# Altium project Motherboard refurb.PrjPcb (part 1 of 2)
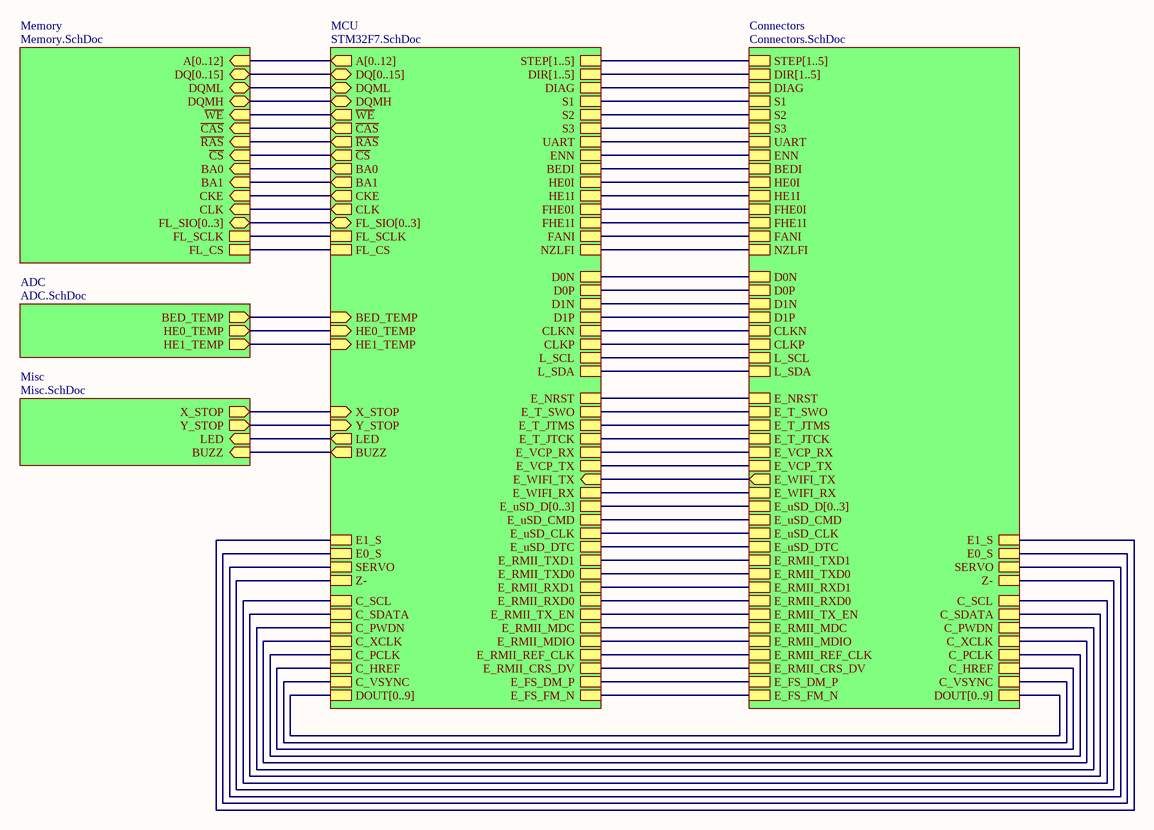
[diagram p0: Motherboard.SchDoc]
6 sheets, 89 parts. Net scope: hierarchical (ports join the sheet entries above them; power ports are global).
Board file: PCB2.PcbDoc
Sheets:
  Motherboard.SchDoc
    MCU = STM32F7.SchDoc
    Connectors = Connectors.SchDoc
    Memory = Memory.SchDoc
    ADC = ADC.SchDoc
    Misc = Misc.SchDoc

## Sheet Motherboard.SchDoc
size A4; SheetNumber: 1; SheetTotal: 6

### Sub-sheets
ADC = ADC.SchDoc: BED_TEMP (out), HE0_TEMP (out), HE1_TEMP (out)
Connectors = Connectors.SchDoc: ENN, STEP[1..5], BEDI, NZLFI, FANI, UART, S3, HE0I, HE1I, S2, S1, FHE0I, FHE1I, DIR[1..5], DIAG, D1N, D1P, D0N, D0P, CLKN, CLKP, L_SCL, L_SDA, E_NRST, E_T_SWO, E_uSD_CLK, E_RMII_TXD0, E_WIFI_RX, E_uSD_D[0..3], E_VCP_RX, E_VCP_TX, E_T_JTCK, E_T_JTMS, E_uSD_DTC, E_FS_DM_P, E_FS_FM_N, E_RMII_CRS_DV, E_RMII_MDC, E_RMII_RXD0, E_RMII_TX_EN, E_uSD_CMD, E_RMII_MDIO, E_RMII_REF_CLK, E_RMII_RXD1, E_RMII_TXD1, DOUT[0..9], C_VSYNC, C_HREF, C_PCLK, C_XCLK, C_PWDN, C_SDATA, C_SCL, Z-, SERVO, E0_S, E1_S, E_WIFI_TX (out)
MCU = STM32F7.SchDoc: A[0..12] (out), DQ[0..15] (bidir), DQML (bidir), DQMH (bidir), ~{WE} (out), ~{CAS} (out), ~{RAS} (out), ~{CS} (out), BA0 (out), BA1 (out), CKE (out), CLK (out), FL_SIO[0..3] (bidir), FL_SCLK, FL_CS, BED_TEMP (in), HE0_TEMP (in), HE1_TEMP (in), X_STOP (in), Y_STOP (in), LED (out), BUZZ (out), STEP[1..5], DIR[1..5], DIAG, S1, S2, S3, UART, ENN, BEDI, HE0I, HE1I, FHE0I, FHE1I, FANI, NZLFI, D0N, D0P, D1N, D1P, CLKN, CLKP, L_SCL, L_SDA, E_NRST, E_T_SWO, E_uSD_CLK, E_RMII_TXD0, E_WIFI_RX, E_T_JTMS, E_T_JTCK, E_VCP_RX, E_VCP_TX, E_uSD_D[0..3], E_uSD_CMD, E_uSD_DTC, E_RMII_TXD1, E_RMII_RXD1, E_RMII_RXD0, E_RMII_TX_EN, E_RMII_MDC, E_RMII_MDIO, E_RMII_REF_CLK, E_RMII_CRS_DV, E_FS_DM_P, E_FS_FM_N, DOUT[0..9], C_VSYNC, C_HREF, C_PCLK, C_XCLK, C_PWDN, C_SDATA, C_SCL, Z-, SERVO, E0_S, E1_S, E_WIFI_TX (in)
Memory = Memory.SchDoc: A[0..12] (in), DQ[0..15] (bidir), DQML (bidir), DQMH (bidir), ~{WE} (in), ~{CAS} (in), ~{RAS} (in), ~{CS} (in), BA0 (in), BA1 (in), CKE (in), CLK (in), FL_SIO[0..3] (bidir), FL_SCLK, FL_CS
Misc = Misc.SchDoc: X_STOP (out), Y_STOP (out), LED (in), BUZZ (in)

### Nets
~{CAS}: sheet MCU/~{CAS}, sheet Memory/~{CAS}
~{CS}: sheet MCU/~{CS}, sheet Memory/~{CS}
~{RAS}: sheet MCU/~{RAS}, sheet Memory/~{RAS}
~{WE}: sheet MCU/~{WE}, sheet Memory/~{WE}
BA0: sheet MCU/BA0, sheet Memory/BA0
BA1: sheet MCU/BA1, sheet Memory/BA1
BED: sheet MCU/BEDI, sheet Connectors/BEDI
BED_TEMP: sheet MCU/BED_TEMP, sheet ADC/BED_TEMP
BUZZER: sheet MCU/BUZZ, sheet Misc/BUZZ
C_VSYNC: sheet MCU/C_VSYNC, sheet Connectors/C_VSYNC
CKE: sheet MCU/CKE, sheet Memory/CKE
CLK: sheet MCU/CLK, sheet Memory/CLK
CLKN: sheet MCU/CLKN, sheet Connectors/CLKN
CLKP: sheet MCU/CLKP, sheet Connectors/CLKP
CS: sheet MCU/FL_CS, sheet Memory/FL_CS
D0N: sheet MCU/D0N, sheet Connectors/D0N
D0P: sheet MCU/D0P, sheet Connectors/D0P
D1N: sheet MCU/D1N, sheet Connectors/D1N
D1P: sheet MCU/D1P, sheet Connectors/D1P
DIAG: sheet MCU/DIAG, sheet Connectors/DIAG
DQMH: sheet MCU/DQMH, sheet Memory/DQMH
DQML: sheet MCU/DQML, sheet Memory/DQML
E0: sheet MCU/E0_S, sheet Connectors/E0_S
E1: sheet MCU/E1_S, sheet Connectors/E1_S
ENN: sheet MCU/ENN, sheet Connectors/ENN
ENRST: sheet MCU/E_NRST, sheet Connectors/E_NRST
ET_JTCK: sheet MCU/E_T_JTCK, sheet Connectors/E_T_JTCK
ET_JTMS: sheet MCU/E_T_JTMS, sheet Connectors/E_T_JTMS
ET_SWO: sheet MCU/E_T_SWO, sheet Connectors/E_T_SWO
FAN: sheet MCU/FANI, sheet Connectors/FANI
FHE0: sheet MCU/FHE0I, sheet Connectors/FHE0I
FHE1: sheet MCU/FHE1I, sheet Connectors/FHE1I
FS_DM_N: sheet MCU/E_FS_FM_N, sheet Connectors/E_FS_FM_N
FS_DM_P: sheet MCU/E_FS_DM_P, sheet Connectors/E_FS_DM_P
HE0: sheet MCU/HE0I, sheet Connectors/HE0I
HE0_TEMP: sheet MCU/HE0_TEMP, sheet ADC/HE0_TEMP
HE1: sheet MCU/HE1I, sheet Connectors/HE1I
HE1_TEMP: sheet MCU/HE1_TEMP, sheet ADC/HE1_TEMP
HREF: sheet MCU/C_HREF, sheet Connectors/C_HREF
LED: sheet MCU/LED, sheet Misc/LED
NZLF: sheet MCU/NZLFI, sheet Connectors/NZLFI
PCLK: sheet MCU/C_PCLK, sheet Connectors/C_PCLK
PWDN: sheet MCU/C_PWDN, sheet Connectors/C_PWDN
RMII_CRS_DV: sheet MCU/E_RMII_CRS_DV, sheet Connectors/E_RMII_CRS_DV
RMII_MDC: sheet MCU/E_RMII_MDC, sheet Connectors/E_RMII_MDC
RMII_MDIO: sheet MCU/E_RMII_MDIO, sheet Connectors/E_RMII_MDIO
RMII_REF_CLK: sheet MCU/E_RMII_REF_CLK, sheet Connectors/E_RMII_REF_CLK
RMII_RXD0: sheet MCU/E_RMII_RXD0, sheet Connectors/E_RMII_RXD0
RMII_RXD1: sheet MCU/E_RMII_RXD1, sheet Connectors/E_RMII_RXD1
RMII_TX_EN: sheet MCU/E_RMII_TX_EN, sheet Connectors/E_RMII_TX_EN
RMII_TXD0: sheet MCU/E_RMII_TXD0, sheet Connectors/E_RMII_TXD0
RMII_TXD1: sheet MCU/E_RMII_TXD1, sheet Connectors/E_RMII_TXD1
S1: sheet MCU/S1, sheet Connectors/S1
S2: sheet MCU/S2, sheet Connectors/S2
S3: sheet MCU/S3, sheet Connectors/S3
SCL: sheet MCU/C_SCL, sheet Connectors/C_SCL
SCL1: sheet MCU/L_SCL, sheet Connectors/L_SCL
SCLK: sheet MCU/FL_SCLK, sheet Memory/FL_SCLK
SDA1: sheet MCU/L_SDA, sheet Connectors/L_SDA
SDATA: sheet MCU/C_SDATA, sheet Connectors/C_SDATA
SRV: sheet MCU/SERVO, sheet Connectors/SERVO
UART: sheet MCU/UART, sheet Connectors/UART
uSD_CLK: sheet MCU/E_uSD_CLK, sheet Connectors/E_uSD_CLK
uSD_CMD: sheet MCU/E_uSD_CMD, sheet Connectors/E_uSD_CMD
uSD_DETECT: sheet MCU/E_uSD_DTC, sheet Connectors/E_uSD_DTC
VCP_RX: sheet MCU/E_VCP_RX, sheet Connectors/E_VCP_RX
VCP_TX: sheet MCU/E_VCP_TX, sheet Connectors/E_VCP_TX
WIFI_RX: sheet MCU/E_WIFI_RX, sheet Connectors/E_WIFI_RX
WIFI_TX: sheet MCU/E_WIFI_TX, sheet Connectors/E_WIFI_TX
X_STOP: sheet MCU/X_STOP, sheet Misc/X_STOP
XCLK: sheet MCU/C_XCLK, sheet Connectors/C_XCLK
Y_STOP: sheet MCU/Y_STOP, sheet Misc/Y_STOP
Z-: sheet MCU/Z-, sheet Connectors/Z-

### Buses and harness runs
bus sheet Connectors/DIR[1..5] = sheet MCU/DIR[1..5]
bus sheet Connectors/DOUT[0..9] = sheet MCU/DOUT[0..9]
bus sheet Connectors/E_uSD_D[0..3] = sheet MCU/E_uSD_D[0..3]
bus sheet Connectors/STEP[1..5] = sheet MCU/STEP[1..5]
bus sheet MCU/A[0..12] = sheet Memory/A[0..12]
bus sheet MCU/DQ[0..15] = sheet Memory/DQ[0..15]
bus sheet MCU/FL_SIO[0..3] = sheet Memory/FL_SIO[0..3]

## Sheet STM32F7.SchDoc
size A4; SheetNumber: 4; SheetTotal: 6
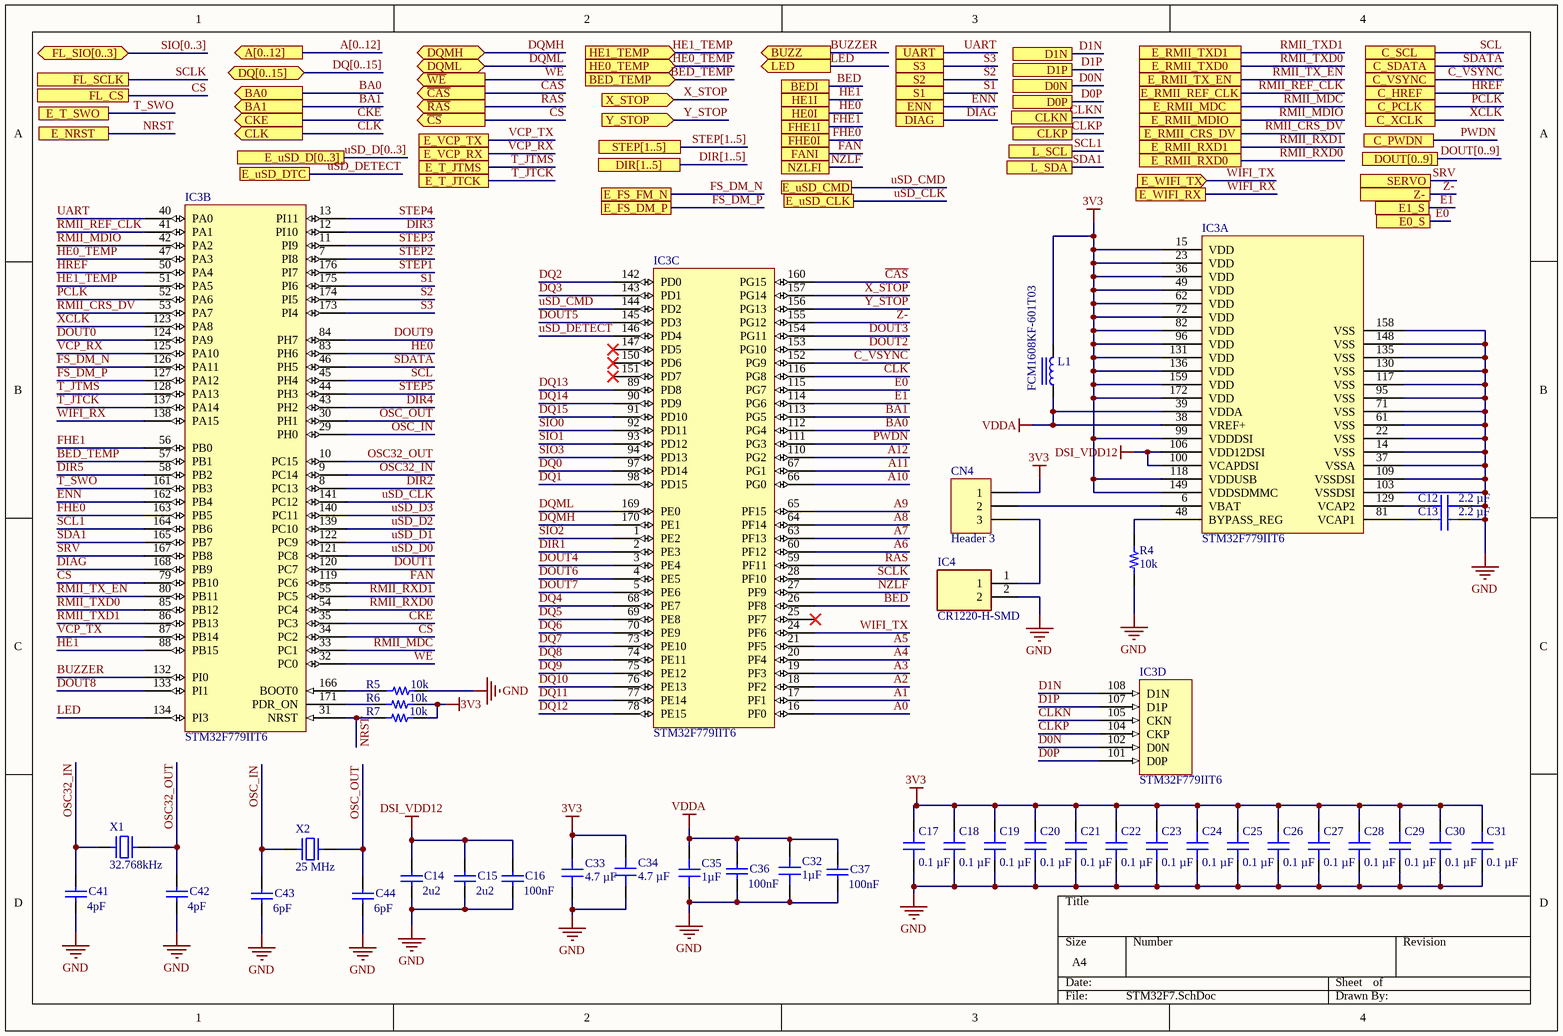
[diagram p1: STM32F7.SchDoc]

### Parts
(Parts that share a designator on the sheet are numbered #1, #2 ... from top to bottom, then left to right.)
C12  2.2 µF  [CAP 0603_1608]
C13  2.2 µF  [CAP 0603_1608]
C14  value 2u2  [1608[0603]]  (hidden comment: X5R)
C15  value 2u2  [1608[0603]]  (hidden comment: X5R)
C16  value 100nF  [1608[0603]]  (hidden comment: X5R)
C17  0.1 µF  [CAP 0603_1608]
C18  0.1 µF  [CAP 0603_1608]
C19  0.1 µF  [CAP 0603_1608]
C20  0.1 µF  [CAP 0603_1608]
C21  0.1 µF  [CAP 0603_1608]
C22  0.1 µF  [CAP 0603_1608]
C23  0.1 µF  [CAP 0603_1608]
C24  0.1 µF  [CAP 0603_1608]
C25  0.1 µF  [CAP 0603_1608]
C26  0.1 µF  [CAP 0603_1608]
C27  0.1 µF  [CAP 0603_1608]
C28  0.1 µF  [CAP 0603_1608]
C29  0.1 µF  [CAP 0603_1608]
C30  0.1 µF  [CAP 0603_1608]
C31  0.1 µF  [CAP 0603_1608]
C32  1µF  [CAP 0603_1608]
C33  4.7 µF  [CAP 0603_1608]
C34  4.7 µF  [CAP 0603_1608]
C35  1µF  [CAP 0603_1608]
C36  value 100nF  [1608[0603]]  (hidden comment: X5R)
C37  value 100nF  [1608[0603]]  (hidden comment: X5R)
C41  value 4pF  [1608[0603]]  (hidden comment: X5R)
C42  value 4pF  [1608[0603]]  (hidden comment: X5R)
C43  value 6pF  [1608[0603]]  (hidden comment: X5R)
C44  value 6pF  [1608[0603]]  (hidden comment: X5R)
CN4  Header 3  [HDR1X3]
IC3#1  STM32F779IIT6  [QFP50P2600X2600X160-176N]  (parts A,B,C of 3)
IC3#2  STM32F779IIT6  [QFP50P2600X2600X160-176N]  (part D of 4)
IC4  CR1220-H-SMD  [CR1220HSMD]
L1  FCM1608KF-601T03  [IND 0603_1608 RF WW]
R4  10k  [RES 0603_1608]
R5  10k  [RES 0603_1608]
R6  10k  [RES 0603_1608]
R7  10k  [RES 0603_1608]
X1  32.768kHz  [NDK NX5032GA]
X2  25 MHz  [NDK NX5032GA]

### Ports
A[0..12] (out, see Motherboard[2A], Memory[2A]), BA0 (out, see Motherboard[2A], Memory[4B]), BA1 (out, see Motherboard[2A], Memory[4B]), BED_TEMP (in, see Motherboard[2B], ADC[3D]), BEDI (see Motherboard[2A], Connectors[1A]), BUZZ (out, see Motherboard[2B], Misc[3C]), C_HREF (see Motherboard[2C], Connectors[2C]), C_PCLK (see Motherboard[2C], Connectors[2C]), C_PWDN (see Motherboard[2C], Connectors[3C]), C_SCL (see Motherboard[2C], Connectors[2C]), C_SDATA (see Motherboard[2C], Connectors[2C]), C_VSYNC (see Motherboard[2C], Connectors[2C]), C_XCLK (see Motherboard[2C], Connectors[2C]), CKE (out, see Motherboard[2A], Memory[4B]), CLK (out, see Motherboard[2A], Memory[4B]), CLKN (see Motherboard[2B], Connectors[3A]), CLKP (see Motherboard[2B], Connectors[3A]), D0N (see Motherboard[2B], Connectors[3A]), D0P (see Motherboard[2B], Connectors[3A]), D1N (see Motherboard[2B], Connectors[3A]), D1P (see Motherboard[2B], Connectors[3A]), DIAG (see Motherboard[2A], Connectors[1B]), DIR[1..5] (see Motherboard[2A], Connectors[2B]), DOUT[0..9] (see Motherboard[2C], Connectors[3B]), DQ[0..15] (bidir, see Motherboard[2A], Memory[3A]), DQMH (bidir, see Motherboard[2A], Memory[4B]), DQML (bidir, see Motherboard[2A], Memory[4B]), E0_S (see Motherboard[2C], Connectors[1C]), E1_S (see Motherboard[2C], Connectors[1C]), E_FS_DM_P (see Motherboard[2C], Connectors[4B]), E_FS_FM_N (see Motherboard[2C], Connectors[4B]), E_NRST (see Motherboard[2B], Connectors[4A]), E_RMII_CRS_DV (see Motherboard[2C], Connectors[4B]), E_RMII_MDC (see Motherboard[2C], Connectors[4B]), E_RMII_MDIO (see Motherboard[2C], Connectors[4B]), E_RMII_REF_CLK (see Motherboard[2C], Connectors[4B]), E_RMII_RXD0 (see Motherboard[2C], Connectors[4B]), E_RMII_RXD1 (see Motherboard[2C], Connectors[4B]), E_RMII_TX_EN (see Motherboard[2C], Connectors[4B]), E_RMII_TXD0 (see Motherboard[2C], Connectors[4B]), E_RMII_TXD1 (see Motherboard[2C], Connectors[4B]), E_T_JTCK (see Motherboard[2B], Connectors[4A]), E_T_JTMS (see Motherboard[2B], Connectors[4A]), E_T_SWO (see Motherboard[2B], Connectors[4A]), E_uSD_CLK (see Motherboard[2C], Connectors[4A]), E_uSD_CMD (see Motherboard[2C], Connectors[4A]), E_uSD_D[0..3] (see Motherboard[2C], Connectors[4A]), E_uSD_DTC (see Motherboard[2C], Connectors[4A]), E_VCP_RX (see Motherboard[2B], Connectors[4A]), E_VCP_TX (see Motherboard[2B], Connectors[4A]), E_WIFI_RX (see Motherboard[2C], Connectors[4B]), E_WIFI_TX (in, see Motherboard[2B], Connectors[4B]), ENN (see Motherboard[2A], Connectors[1B]), FANI (see Motherboard[2B], Connectors[1A]), FHE0I (see Motherboard[2A], Connectors[1A]), FHE1I (see Motherboard[2A], Connectors[1A]), FL_CS (see Motherboard[2B], Memory[2C]), FL_SCLK (see Motherboard[2B], Memory[2C]), FL_SIO[0..3] (bidir, see Motherboard[2A], Memory[2C]), HE0_TEMP (in, see Motherboard[2B], ADC[1D]), HE0I (see Motherboard[2A], Connectors[1A]), HE1_TEMP (in, see Motherboard[2B], ADC[3C]), HE1I (see Motherboard[2A], Connectors[1A]), L_SCL (see Motherboard[2B], Connectors[3A]), L_SDA (see Motherboard[2B], Connectors[3A]), LED (out, see Motherboard[2B], Misc[3B]), NZLFI (see Motherboard[2B], Connectors[1A]), S1 (see Motherboard[2A], Connectors[1B]), S2 (see Motherboard[2A], Connectors[1B]), S3 (see Motherboard[2A], Connectors[1B]), SERVO (see Motherboard[2C], Connectors[1D]), STEP[1..5] (see Motherboard[2A], Connectors[2B]), UART (see Motherboard[2A], Connectors[1B]), X_STOP (in, see Motherboard[2B], Misc[3B]), Y_STOP (in, see Motherboard[2B], Misc[3B]), Z- (see Motherboard[2C], Connectors[1D]), ~{CAS} (out, see Motherboard[2A], Memory[4B]), ~{CS} (out, see Motherboard[2A], Memory[4B]), ~{RAS} (out, see Motherboard[2A], Memory[4B]), ~{WE} (out, see Motherboard[2A], Memory[4B])

### Nets
3V3: C17.2 C18.2 C19.2 C20.2 C21.2 C22.2 C23.2 C24.2 C25.2 C26.2 C27.2 C28.2 C29.2 C30.2 C31.2 C33.2 C34.2 CN4.1 IC3#1.15(VDD) IC3#1.23(VDD) IC3#1.36(VDD) IC3#1.49(VDD) IC3#1.62(VDD) IC3#1.72(VDD) IC3#1.82(VDD) IC3#1.96(VDD) IC3#1.99(VDDDSI) IC3#1.118(VDDUSB) IC3#1.131(VDD) IC3#1.136(VDD) IC3#1.149(VDDSDMMC) IC3#1.159(VDD) IC3#1.172(VDD) L1.2 R6.1 R7.2
DSI_VDD12: C14.1 C15.1 C16.1 IC3#1.100(VCAPDSI) IC3#1.106(VDD12DSI)
GND: C12.1 C13.1 C14.2 C15.2 C16.2 C17.1 C18.1 C19.1 C20.1 C21.1 C22.1 C23.1 C24.1 C25.1 C26.1 C27.1 C28.1 C29.1 C30.1 C31.1 C32.1 C33.1 C34.1 C35.1 C36.2 C37.2 C41.2 C42.2 C43.2 C44.2 IC3#1.14(VSS) IC3#1.22(VSS) IC3#1.37(VSSA) IC3#1.61(VSS) IC3#1.71(VSS) IC3#1.95(VSS) IC3#1.103(VSSDSI) IC3#1.109(VSSDSI) IC3#1.117(VSS) IC3#1.130(VSS) IC3#1.135(VSS) IC3#1.148(VSS) IC3#1.158(VSS) IC4.2 R4.2 R5.2
VDDA: C32.2 C35.2 C36.1 C37.1 IC3#1.38(VREF+) IC3#1.39(VDDA) L1.1
~{CAS}: IC3#1.160(PG15) ; port ~{CAS}
~{CS}: IC3#1.34(PC2) ; port ~{CS}
~{RAS}: IC3#1.59(PF11) ; port ~{RAS}
~{WE}: IC3#1.32(PC0) ; port ~{WE}
A0: IC3#1.16(PF0)
A1: IC3#1.17(PF1)
A2: IC3#1.18(PF2)
A3: IC3#1.19(PF3)
A4: IC3#1.20(PF4)
A5: IC3#1.21(PF5)
A6: IC3#1.60(PF12)
A7: IC3#1.63(PF13)
A8: IC3#1.64(PF14)
A9: IC3#1.65(PF15)
A10: IC3#1.66(PG0)
A11: IC3#1.67(PG1)
A12: IC3#1.110(PG2)
BA0: IC3#1.112(PG4) ; port BA0
BA1: IC3#1.113(PG5) ; port BA1
BED: IC3#1.26(PF8) ; port BEDI
BED_TEMP: IC3#1.57(PB1) ; port BED_TEMP
BUZZER: IC3#1.132(PI0) ; port BUZZ
C_VSYNC: IC3#1.152(PG9) ; port C_VSYNC
CKE: IC3#1.35(PC3) ; port CKE
CLK: IC3#1.116(PG8) ; port CLK
CLKN: IC3#2.105(CKN) ; port CLKN
CLKP: IC3#2.104(CKP) ; port CLKP
CS: IC3#1.79(PB10) ; port FL_CS
D0N: IC3#2.102(D0N) ; port D0N
D0P: IC3#2.101(D0P) ; port D0P
D1N: IC3#2.108(D1N) ; port D1N
D1P: IC3#2.107(D1P) ; port D1P
DIAG: IC3#1.168(PB9) ; port DIAG
DIR1: IC3#1.2(PE3)
DIR2: IC3#1.8(PC13)
DIR3: IC3#1.12(PI10)
DIR4: IC3#1.43(PH2)
DIR5: IC3#1.58(PB2)
DOUT0: IC3#1.124(PA9)
DOUT1: IC3#1.120(PC7)
DOUT2: IC3#1.153(PG10)
DOUT3: IC3#1.154(PG11)
DOUT4: IC3#1.3(PE4)
DOUT5: IC3#1.145(PD3)
DOUT6: IC3#1.4(PE5)
DOUT7: IC3#1.5(PE6)
DOUT8: IC3#1.133(PI1)
DOUT9: IC3#1.84(PH7)
DQ0: IC3#1.97(PD14)
DQ1: IC3#1.98(PD15)
DQ2: IC3#1.142(PD0)
DQ3: IC3#1.143(PD1)
DQ4: IC3#1.68(PE7)
DQ5: IC3#1.69(PE8)
DQ6: IC3#1.70(PE9)
DQ7: IC3#1.73(PE10)
DQ8: IC3#1.74(PE11)
DQ9: IC3#1.75(PE12)
DQ10: IC3#1.76(PE13)
DQ11: IC3#1.77(PE14)
DQ12: IC3#1.78(PE15)
DQ13: IC3#1.89(PD8)
DQ14: IC3#1.90(PD9)
DQ15: IC3#1.91(PD10)
DQMH: IC3#1.170(PE1) ; port DQMH
DQML: IC3#1.169(PE0) ; port DQML
E0: IC3#1.115(PG7) ; port E0_S
E1: IC3#1.114(PG6) ; port E1_S
ENN: IC3#1.162(PB4) ; port ENN
FAN: IC3#1.119(PC6) ; port FANI
FHE0: IC3#1.163(PB5) ; port FHE0I
FHE1: IC3#1.56(PB0) ; port FHE1I
FS_DM_N: IC3#1.126(PA11) ; port E_FS_FM_N
FS_DM_P: IC3#1.127(PA12) ; port E_FS_DM_P
HE0: IC3#1.83(PH6) ; port HE0I
HE0_TEMP: IC3#1.47(PA3) ; port HE0_TEMP
HE1: IC3#1.88(PB15) ; port HE1I
HE1_TEMP: IC3#1.51(PA5) ; port HE1_TEMP
HREF: IC3#1.50(PA4) ; port C_HREF
LED: IC3#1.134(PI3) ; port LED
NRST: IC3#1.31(NRST) R7.1 ; port E_NRST  [project net ENRST]
NZLF: IC3#1.27(PF9) ; port NZLFI
OSC32_IN: C41.1 IC3#1.9(PC14) X1.1
OSC32_OUT: C42.1 IC3#1.10(PC15) X1.2
OSC_IN: C43.1 IC3#1.29(PH0) X2.1
OSC_OUT: C44.1 IC3#1.30(PH1) X2.2
PCLK: IC3#1.52(PA6) ; port C_PCLK
PWDN: IC3#1.111(PG3) ; port C_PWDN
RMII_CRS_DV: IC3#1.53(PA7) ; port E_RMII_CRS_DV
RMII_MDC: IC3#1.33(PC1) ; port E_RMII_MDC
RMII_MDIO: IC3#1.42(PA2) ; port E_RMII_MDIO
RMII_REF_CLK: IC3#1.41(PA1) ; port E_RMII_REF_CLK
RMII_RXD0: IC3#1.54(PC4) ; port E_RMII_RXD0
RMII_RXD1: IC3#1.55(PC5) ; port E_RMII_RXD1
RMII_TX_EN: IC3#1.80(PB11) ; port E_RMII_TX_EN
RMII_TXD0: IC3#1.85(PB12) ; port E_RMII_TXD0
RMII_TXD1: IC3#1.86(PB13) ; port E_RMII_TXD1
S1: IC3#1.175(PI6) ; port S1
S2: IC3#1.174(PI5) ; port S2
S3: IC3#1.173(PI4) ; port S3
SCL: IC3#1.45(PH4) ; port C_SCL
SCL1: IC3#1.164(PB6) ; port L_SCL
SCLK: IC3#1.28(PF10) ; port FL_SCLK
SDA1: IC3#1.165(PB7) ; port L_SDA
SDATA: IC3#1.46(PH5) ; port C_SDATA
SIO0: IC3#1.92(PD11)
SIO1: IC3#1.93(PD12)
SIO2: IC3#1.1(PE2)
SIO3: IC3#1.94(PD13)
SRV: IC3#1.167(PB8) ; port SERVO
STEP1: IC3#1.176(PI7)
STEP2: IC3#1.7(PI8)
STEP3: IC3#1.11(PI9)
STEP4: IC3#1.13(PI11)
STEP5: IC3#1.44(PH3)
T_JTCK: IC3#1.137(PA14) ; port E_T_JTCK  [project net ET_JTCK]
T_JTMS: IC3#1.128(PA13) ; port E_T_JTMS  [project net ET_JTMS]
T_SWO: IC3#1.161(PB3) ; port E_T_SWO  [project net ET_SWO]
UART: IC3#1.40(PA0) ; port UART
uSD_CLK: IC3#1.141(PC12) ; port E_uSD_CLK
uSD_CMD: IC3#1.144(PD2) ; port E_uSD_CMD
uSD_D0: IC3#1.121(PC8)
uSD_D1: IC3#1.122(PC9)
uSD_D2: IC3#1.139(PC10)
uSD_D3: IC3#1.140(PC11)
uSD_DETECT: IC3#1.146(PD4) ; port E_uSD_DTC
VCP_RX: IC3#1.125(PA10) ; port E_VCP_RX
VCP_TX: IC3#1.87(PB14) ; port E_VCP_TX
WIFI_RX: IC3#1.138(PA15) ; port E_WIFI_RX
WIFI_TX: IC3#1.24(PF6) ; port E_WIFI_TX
X_STOP: IC3#1.157(PG14) ; port X_STOP
XCLK: IC3#1.123(PA8) ; port C_XCLK
Y_STOP: IC3#1.156(PG13) ; port Y_STOP
Z-: IC3#1.155(PG12) ; port Z-
NetC12_2: C12.2 IC3#1.129(VCAP2)
NetC13_2: C13.2 IC3#1.81(VCAP1)
NetCN4_2: CN4.2 IC3#1.6(VBAT)
NetCN4_3: CN4.3 IC4.1
NetIC3#1_48: IC3#1.48(BYPASS_REG) R4.1
NetIC3#1_166: IC3#1.166(BOOT0) R5.1
NetIC3#1_171: IC3#1.171(PDR_ON) R6.2

Not connected (* = marked no-connect by the designer): IC3#1 25(PF7)* 147(PD5)* 150(PD6)* 151(PD7)*

### Buses and harness runs
bus A[0..12] =  = port A[0..12]
bus DIR[1..5] = port DIR[1..5]
bus DOUT[0..9] = port DOUT[0..9]
bus DQ[0..15] = port DQ[0..15]
bus SIO[0..3] = port FL_SIO[0..3]
bus STEP[1..5] = port STEP[1..5]
bus uSD_D[0..3] = port E_uSD_D[0..3]

### Library data of the parts
C12 C13 = CGA3E1X7R0J225M080AC: CAP CER 2.2UF 6.3V X7R 0603; manufacturer: TDK Corporation; Tolerance: ±20%; Part Number: CGA3E1X7R0J225M080AC; Value: 2.2 µF; Applications: Automotive; Capacitance: 2.2 µF; componentlink1description: Datasheet; componentlink1url: https://product.tdk.com/info/en/catalog/datasheets/mlcc_automotive_general_en.pdf?ref_disty=digikey; componentlink2description: DigiKey Link; componentlink2url: https://www.digikey.com/en/products/detail/tdk-corporation/CGA3E1X7R0J225M080AC/3949808; Device Package: 0603 (1608 Metric); lastupdated: 4/18/2023 7:09:18 PM; Lifecycle Status: Active; Minimum Order: 1; Mounting Type: Surface Mount, MLCC; Operating Temperature: -55°C ~ 125°C; Package / Case: 0603 (1608 Metric); packaging: TapeAndReel; partid: 13580; Part Status: Active; price: 0.03; Ratings: AEC-Q200; series: CGA; Size / Dimension: 0.063" L x 0.031" W (1.60mm x 0.80mm); Supplier 1: DigiKey; Supplier Part Number 1: 445-12572-1-ND; Temperature Coefficient: X7R; Thickness (Max): 0.035" (0.90mm); Voltage - Rated: 6.3V
C14-C16 C36 C37 C41-C44 = Cap: Capacitor; Published: 8-Jun-2000; LatestRevisionDate: 17-Jul-2002; LatestRevisionNote: Re-released for DXP Platform.; PackageReference: RAD-0.3; Publisher: Altium Limited; PackageDescription: Radial Cap, Thru-Hole; 2 Leads; 0.3 in Pin Spacing
C17-C31 = 0603B104K101CT: CAP CER 0.1UF 100V X7R 0603; manufacturer: Walsin Technology Corporation; Tolerance: ±10%; Part Number: 0603B104K101CT; Value: 0.1 µF; Applications: General Purpose; Capacitance: 0.1 µF; componentlink1description: Datasheet; componentlink1url: http://www.passivecomponent.com/wp-content/uploads/2018/10/MLCC.pdf; componentlink2description: DigiKey Link; componentlink2url: https://www.digikey.com/en/products/detail/walsin-technology-corporation/0603B104K101CT/9354889; Device Package: 0603 (1608 Metric); lastupdated: 4/8/2023 7:09:18 PM; Lifecycle Status: Active; Minimum Order: 1; Mounting Type: Surface Mount, MLCC; Operating Temperature: -55°C ~ 125°C; Package / Case: 0603 (1608 Metric); packaging: TapeAndReel; partid: 4273; Part Status: Active; price: 0.01; series: -; Size / Dimension: 0.063" L x 0.031" W (1.60mm x 0.80mm); Supplier 1: DigiKey; Supplier Part Number 1: 1292-1392-1-ND; Temperature Coefficient: X7R; Thickness (Max): 0.037" (0.95mm); Voltage - Rated: 100V
C32 C35 = 0603YD105KAT4A: CAP CER 1UF 16V X5R 0603; manufacturer: AVX Corporation; Tolerance: ±10%; Part Number: 0603YD105KAT4A; Value: 1µF; Applications: General Purpose; Capacitance: 1µF; componentlink1description: Datasheet; componentlink1url: http://datasheets.avx.com/cx5r.pdf; componentlink2description: DigiKey Link; componentlink2url: http://digikey.com/product-detail/en/avx-corporation/0603YD105KAT4A/478-10365-1-ND/6797443; Device Package: 0603 (1608 Metric); lastupdated: 9/2/2020 1:03:10 AM; Lifecycle Status: Active; Minimum Order: 1; Mounting Type: Surface Mount, MLCC; Operating Temperature: -55°C ~ 85°C; Package / Case: 0603 (1608 Metric); packaging: TapeAndReel; partid: 15257; Part Status: Active; price: 0.03; series: -; Size / Dimension: 0.063" L x 0.032" W (1.60mm x 0.81mm); Supplier 1: DigiKey; Supplier Part Number 1: 478-10365-1-ND; Temperature Coefficient: X5R; Thickness (Max): 0.035" (0.90mm); Voltage - Rated: 16V
C33 C34 = GRM185R61C475KE11D: CAP CER 4.7UF 16V X5R 0603; manufacturer: Murata Electronics; Tolerance: ±10%; Part Number: GRM185R61C475KE11D; Value: 4.7 µF; Applications: General Purpose; Capacitance: 4.7 µF; componentlink1description: Datasheet; componentlink1url: https://search.murata.co.jp/Ceramy/image/img/A01X/G101/ENG/GRM185R61C475KE11-01.pdf; componentlink2description: DigiKey Link; componentlink2url: https://www.digikey.com/en/products/detail/murata-electronics/GRM185R61C475KE11D/6606088; Device Package: 0603 (1608 Metric); lastupdated: 3/28/2023 7:09:04 PM; Lifecycle Status: Active; Minimum Order: 1; Mounting Type: Surface Mount, MLCC; Operating Temperature: -55°C ~ 85°C; Package / Case: 0603 (1608 Metric); packaging: TapeAndReel; partid: 2451; Part Status: Active; price: 0.05; series: GRM; Size / Dimension: 0.063" L x 0.031" W (1.60mm x 0.80mm); Supplier 1: DigiKey; Supplier Part Number 1: 490-14459-1-ND; Temperature Coefficient: X5R; Thickness (Max): 0.022" (0.55mm); Voltage - Rated: 16V
CN4 = Header 3: Header, 3-Pin; LatestRevisionDate: 17-Jul-2002; LatestRevisionNote: Re-released for DXP Platform.; Publisher: Altium Limited
IC3#1 IC3#2 = STM32F779IIT6: Integrated Circuit; Manufacturer_Name: STMicroelectronics; Datasheet Link: https://www.arrow.com/en/products/stm32f779iit6/stmicroelectronics; Height: 1.6mm; Manufacturer_Part_Number: STM32F779IIT6; Mouser Part Number: 511-STM32F779IIT6; Mouser Price/Stock: https://www.mouser.co.uk/ProductDetail/STMicroelectronics/STM32F779IIT6?qs=qzCNEk%252BRr%252BabClKc4EG9PA%3D%3D; Arrow Part Number: STM32F779IIT6; Arrow Price/Stock: https://www.arrow.com/en/products/stm32f779iit6/stmicroelectronics?region=nac
IC4 = CR1220-H-SMD: Integrated Circuit; Manufacturer_Name: ROBOTIS; Datasheet Link: https://www.robotics.org.za/CR1220-H-SMD; Height: 4.1mm; Manufacturer_Part_Number: CR1220-H-SMD
L1 = 744917127: FIXED IND 27NH 780MA 200 MOHM; Manufacturer: Würth Elektronik; DC Resistance (DCR): 200mOhm Max; Frequency - Self Resonant: 2.8GHz; Inductance Frequency - Test: 250MHz; Material - Core: Ceramic; Q @ Freq: 35 @ 250MHz; Shielding: Unshielded; Tolerance: ±2%; Type: Wirewound; Part Number: 744917127; ComponentLink1Description: Datasheet; ComponentLink1URL: https://katalog.we-online.de/pbs/datasheet/744917127.pdf; ComponentLink2Description: DigiKey Link; ComponentLink2URL: http://digikey.com/product-detail/en/w-rth-elektronik/744917127/732-11279-1-ND/6833738; Current Rating (Amps): 780mA; Device Package: 0603 (1608 Metric); Height - Seated (Max): 0.043" (1.10mm); Inductance: 27nH; LastUpdated: 9/6/2020 11:05:16 AM; Lifecycle Status: Active; Minimum Order: 0; Mounting Type: Surface Mount; Operating Temperature: -40°C ~ 125°C; Package / Case: 0603 (1608 Metric); Packaging: TapeAndReel; PartId: 832; Part Status: Active; Price: 0.46; Series: WE-KI HC; Size / Dimension: 0.067" L x 0.043" W (1.70mm x 1.10mm); Supplier 1: DigiKey; Supplier Part Number 1: 732-11279-1-ND; Supplier Device Package: 0603 (1608 Metric); Value: 27nH
R4-R7 = RC0603FR-7W10KL: RES 10K OHM 1% 1/5W 0603; Manufacturer: Yageo; Power (Watts): 0.2W, 1/5W; Resistance: 10 kOhms; Temperature Coefficient: ±200ppm/°C; Part Number: RC0603FR-7W10KL; Value: 10k; ComponentLink1Description: Datasheet; ComponentLink1URL: https://www.yageo.com/upload/media/product/productsearch/datasheet/rchip/PYu-RC_Group_51_RoHS_L_11.pdf; ComponentLink2Description: DigiKey Link; ComponentLink2URL: https://www.digikey.com/en/products/detail/yageo/RC0603FR-7W10KL/12698809; Composition: Thick Film; Device Package: 0603 (1608 Metric); Features: Moisture Resistant; Height - Seated (Max): 0.022" (0.55mm); LastUpdated: 4/8/2023 7:28:57 PM; Lifecycle Status: Active; Minimum Order: 1; Number of Terminations: 2; Operating Temperature: -55°C ~ 155°C; Package / Case: 0603 (1608 Metric); Packaging: CutTape; PartId: 67088; Part Status: Active; Price: 0.01; Series: RC_L; Size / Dimension: 0.063" L x 0.031" W (1.60mm x 0.80mm); Supplier 1: DigiKey; Supplier Part Number 1: 13-RC0603FR-7W10KLCT-ND; Supplier Device Package: 0603; Tolerance: ±1%
X1 = NX5032GA-25.000000MHZ-LN-CD-1: CRYSTAL 25.0000MHZ 8PF SMD; Manufacturer: NDK America, Inc.; ESR (Equivalent Series Resistance): 70 Ohms; Frequency: 25 MHz; Frequency Stability: ±50ppm; Operating Mode: Fundamental; Value: 25 MHz; Part Number: NX5032GA-25.000000MHZ-LN-CD-1; ComponentLink1Description: Datasheet; ComponentLink1URL: //media.digikey.com/pdf/Data%20Sheets/NDK%20PDFs/NX5032GA.pdf; ComponentLink2Description: DigiKey Link; ComponentLink2URL: https://www.digikey.com/en/products/detail/ndk-america-inc/NX5032GA-25-000000MHZ-LN-CD-1/1128823; Frequency Tolerance: ±50ppm; Height - Seated (Max): 0.059" (1.50mm); LastUpdated: 3/28/2023 8:00:45 PM; Lifecycle Status: Active; Load Capacitance: 8pF; Minimum Order: 1; Mounting Type: Surface Mount; Operating Temperature: -10°C ~ 70°C; Package / Case: 2-SMD, No Lead; Packaging: TapeAndReel; PartId: 621; Part Status: Active; Price: 0.28; Series: NX5032GA; Size / Dimension: 0.197" L x 0.126" W (5.00mm x 3.20mm); Supplier 1: DigiKey; Supplier Part Number 1: 644-1041-1-ND; Type: MHz Crystal
X2 = NX5032GA-25.000000MHZ-LN-CD-1: CRYSTAL 25.0000MHZ 8PF SMD; Manufacturer: NDK America, Inc.; ESR (Equivalent Series Resistance): 70 Ohms; Frequency Stability: ±50ppm; Operating Mode: Fundamental; Part Number: NX5032GA-25.000000MHZ-LN-CD-1; ComponentLink1Description: Datasheet; ComponentLink1URL: //media.digikey.com/pdf/Data%20Sheets/NDK%20PDFs/NX5032GA.pdf; ComponentLink2Description: DigiKey Link; ComponentLink2URL: https://www.digikey.com/en/products/detail/ndk-america-inc/NX5032GA-25-000000MHZ-LN-CD-1/1128823; Frequency: 25 MHz; Frequency Tolerance: ±50ppm; Height - Seated (Max): 0.059" (1.50mm); LastUpdated: 3/28/2023 8:00:45 PM; Lifecycle Status: Active; Load Capacitance: 8pF; Minimum Order: 1; Mounting Type: Surface Mount; Operating Temperature: -10°C ~ 70°C; Package / Case: 2-SMD, No Lead; Packaging: TapeAndReel; PartId: 621; Part Status: Active; Price: 0.28; Series: NX5032GA; Size / Dimension: 0.197" L x 0.126" W (5.00mm x 3.20mm); Supplier 1: DigiKey; Supplier Part Number 1: 644-1041-1-ND; Type: MHz Crystal; Value: 25 MHz

## Sheet Connectors.SchDoc
size A4; SheetNumber: 6; SheetTotal: 6
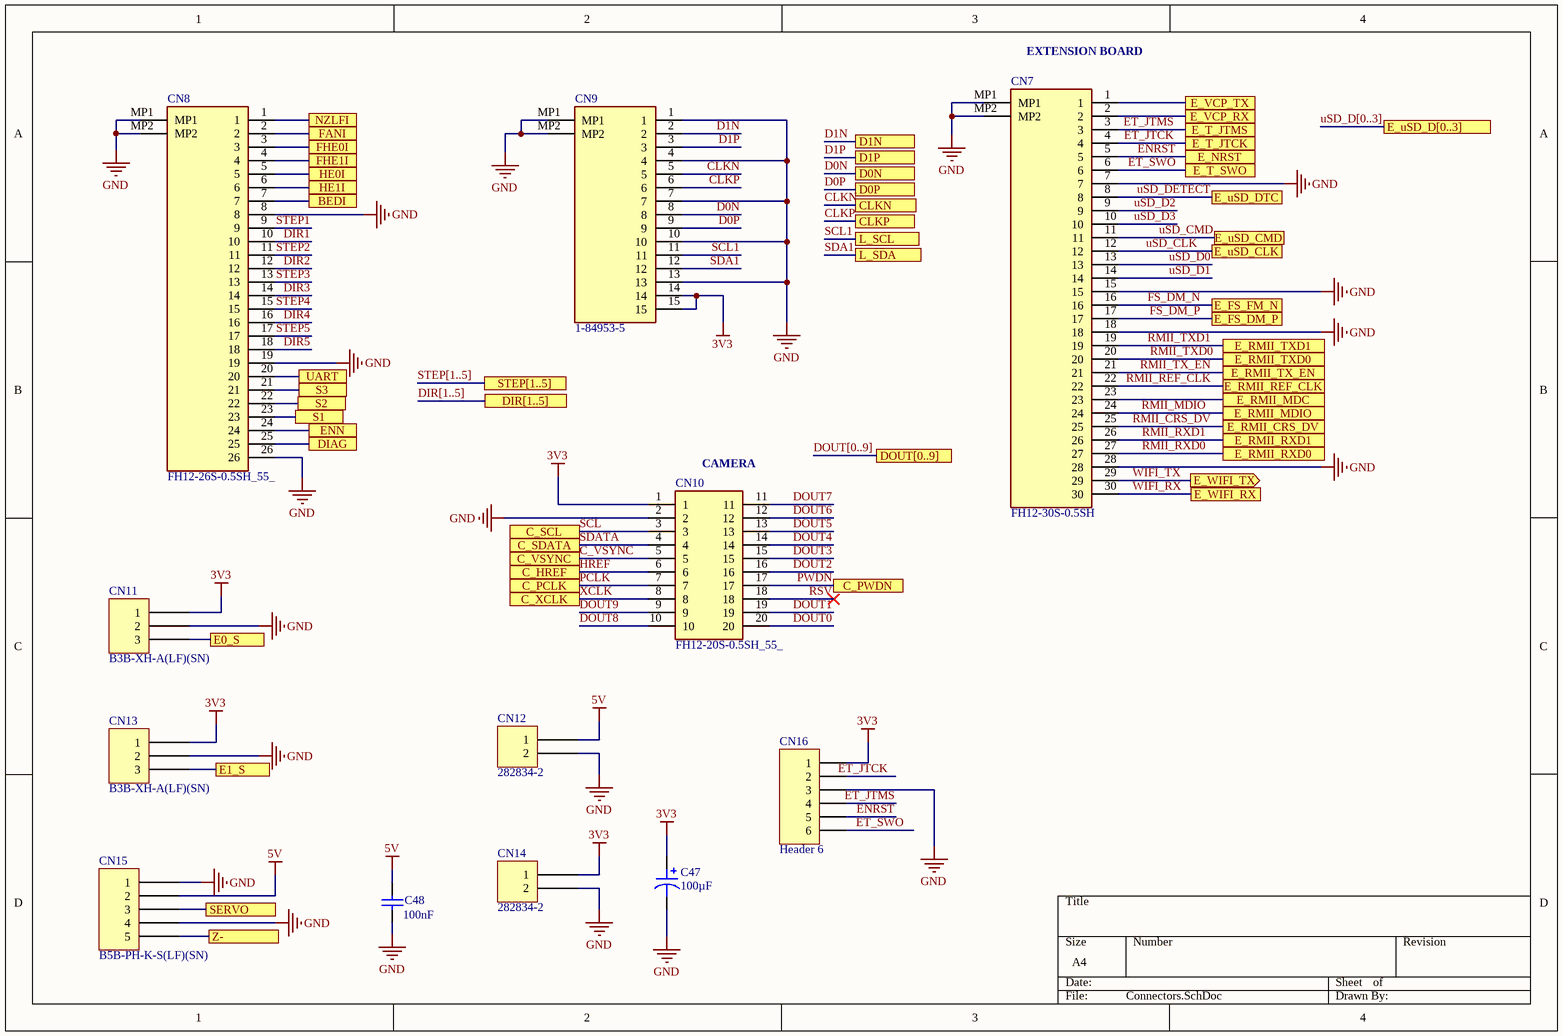
[diagram p2: Connectors.SchDoc]

### Parts
C47  100µF  [CAP ALSMD POLY 5.3MM H6.0MM]
C48  value 100nF  [1608[0603]]  (hidden comment: X5R)
CN7  FH12-30S-0.5SH  [FH1230S05SH]
CN8  FH12-26S-0.5SH_55_  [FH1226S05SH55]
CN9  1-84953-5  [1849535]
CN10  FH12-20S-0.5SH_55_  [FH12-20S-0.5SH(55)]
CN11  B3B-XH-A(LF)(SN)  [JST XH B3B-XH-A]
CN12  282834-2  [TE 282834-2]
CN13  B3B-XH-A(LF)(SN)  [JST XH B3B-XH-A]
CN14  282834-2  [TE 282834-2]
CN15  B5B-PH-K-S(LF)(SN)  [JST B5B-PH-K]
CN16  Header 6  [HDR1X6]

### Ports
BEDI (see Motherboard[3A], STM32F7[3A]), C_HREF (see Motherboard[3C], STM32F7[4A]), C_PCLK (see Motherboard[3C], STM32F7[4A]), C_PWDN (see Motherboard[3C], STM32F7[4A]), C_SCL (see Motherboard[3C], STM32F7[4A]), C_SDATA (see Motherboard[3C], STM32F7[4A]), C_VSYNC (see Motherboard[3C], STM32F7[4A]), C_XCLK (see Motherboard[3C], STM32F7[4A]), CLKN (see Motherboard[3B], STM32F7[3A]), CLKP (see Motherboard[3B], STM32F7[3A]), D0N (see Motherboard[3B], STM32F7[3A]), D0P (see Motherboard[3B], STM32F7[3A]), D1N (see Motherboard[3B], STM32F7[3A]), D1P (see Motherboard[3B], STM32F7[3A]), DIAG (see Motherboard[3A], STM32F7[3A]), DIR[1..5] (see Motherboard[3A], STM32F7[2A]), DOUT[0..9] (see Motherboard[3C], STM32F7[4A]), E0_S (see Motherboard[3C], STM32F7[4A]), E1_S (see Motherboard[3C], STM32F7[4A]), E_FS_DM_P (see Motherboard[3C], STM32F7[2A]), E_FS_FM_N (see Motherboard[3C], STM32F7[2A]), E_NRST (see Motherboard[3B], STM32F7[1A]), E_RMII_CRS_DV (see Motherboard[3C], STM32F7[3A]), E_RMII_MDC (see Motherboard[3C], STM32F7[3A]), E_RMII_MDIO (see Motherboard[3C], STM32F7[3A]), E_RMII_REF_CLK (see Motherboard[3C], STM32F7[3A]), E_RMII_RXD0 (see Motherboard[3C], STM32F7[3A]), E_RMII_RXD1 (see Motherboard[3C], STM32F7[3A]), E_RMII_TX_EN (see Motherboard[3C], STM32F7[3A]), E_RMII_TXD0 (see Motherboard[3C], STM32F7[3A]), E_RMII_TXD1 (see Motherboard[3C], STM32F7[3A]), E_T_JTCK (see Motherboard[3B], STM32F7[2A]), E_T_JTMS (see Motherboard[3B], STM32F7[2A]), E_T_SWO (see Motherboard[3B], STM32F7[1A]), E_uSD_CLK (see Motherboard[3C], STM32F7[3A]), E_uSD_CMD (see Motherboard[3C], STM32F7[3A]), E_uSD_D[0..3] (see Motherboard[3C], STM32F7[1A]), E_uSD_DTC (see Motherboard[3C], STM32F7[1A]), E_VCP_RX (see Motherboard[3B], STM32F7[2A]), E_VCP_TX (see Motherboard[3B], STM32F7[2A]), E_WIFI_RX (see Motherboard[3C], STM32F7[3A]), E_WIFI_TX (out, see Motherboard[3B], STM32F7[3A]), ENN (see Motherboard[3A], STM32F7[3A]), FANI (see Motherboard[3B], STM32F7[3A]), FHE0I (see Motherboard[3A], STM32F7[3A]), FHE1I (see Motherboard[3A], STM32F7[3A]), HE0I (see Motherboard[3A], STM32F7[3A]), HE1I (see Motherboard[3A], STM32F7[3A]), L_SCL (see Motherboard[3B], STM32F7[3A]), L_SDA (see Motherboard[3B], STM32F7[3A]), NZLFI (see Motherboard[3B], STM32F7[3A]), S1 (see Motherboard[3A], STM32F7[3A]), S2 (see Motherboard[3A], STM32F7[3A]), S3 (see Motherboard[3A], STM32F7[3A]), SERVO (see Motherboard[3C], STM32F7[4A]), STEP[1..5] (see Motherboard[3A], STM32F7[2A]), UART (see Motherboard[3A], STM32F7[3A]), Z- (see Motherboard[3C], STM32F7[4A])

### Nets
3V3: C47.1 CN9.14 CN9.15 CN10.1 CN11.1 CN13.1 CN14.1 CN16.1
5V: C48.1 CN12.1 CN15.2
GND: C47.2 C48.2 CN7.7 CN7.15 CN7.18 CN7.28 CN7.MP1 CN7.MP2 CN8.8 CN8.19 CN8.26 CN8.MP1 CN8.MP2 CN9.1 CN9.4 CN9.7 CN9.10 CN9.13 CN9.MP1 CN9.MP2 CN10.2 CN11.2 CN12.2 CN13.2 CN14.2 CN15.1 CN15.4 CN16.3
BED: CN8.7 ; port BEDI
C_VSYNC: CN10.5 ; port C_VSYNC
CLKN: CN9.5 ; port CLKN
CLKP: CN9.6 ; port CLKP
D0N: CN9.8 ; port D0N
D0P: CN9.9 ; port D0P
D1N: CN9.2 ; port D1N
D1P: CN9.3 ; port D1P
DIAG: CN8.25 ; port DIAG
DIR1: CN8.10
DIR2: CN8.12
DIR3: CN8.14
DIR4: CN8.16
DIR5: CN8.18
DOUT0: CN10.20
DOUT1: CN10.19
DOUT2: CN10.16
DOUT3: CN10.15
DOUT4: CN10.14
DOUT5: CN10.13
DOUT6: CN10.12
DOUT7: CN10.11
DOUT8: CN10.10
DOUT9: CN10.9
E0: CN11.3 ; port E0_S
E1: CN13.3 ; port E1_S
ENN: CN8.24 ; port ENN
ENRST: CN7.5 CN16.5 ; port E_NRST
ET_JTCK: CN7.4 CN16.2 ; port E_T_JTCK
ET_JTMS: CN7.3 CN16.4 ; port E_T_JTMS
ET_SWO: CN7.6 CN16.6 ; port E_T_SWO
FAN: CN8.2 ; port FANI
FHE0: CN8.3 ; port FHE0I
FHE1: CN8.4 ; port FHE1I
FS_DM_N: CN7.16 ; port E_FS_FM_N
FS_DM_P: CN7.17 ; port E_FS_DM_P
HE0: CN8.5 ; port HE0I
HE1: CN8.6 ; port HE1I
HREF: CN10.6 ; port C_HREF
NZLF: CN8.1 ; port NZLFI
PCLK: CN10.7 ; port C_PCLK
PWDN: CN10.17 ; port C_PWDN
RMII_CRS_DV: CN7.25 ; port E_RMII_CRS_DV
RMII_MDC: CN7.23 ; port E_RMII_MDC
RMII_MDIO: CN7.24 ; port E_RMII_MDIO
RMII_REF_CLK: CN7.22 ; port E_RMII_REF_CLK
RMII_RXD0: CN7.27 ; port E_RMII_RXD0
RMII_RXD1: CN7.26 ; port E_RMII_RXD1
RMII_TX_EN: CN7.21 ; port E_RMII_TX_EN
RMII_TXD0: CN7.20 ; port E_RMII_TXD0
RMII_TXD1: CN7.19 ; port E_RMII_TXD1
RSV: CN10.18
S1: CN8.23 ; port S1
S2: CN8.22 ; port S2
S3: CN8.21 ; port S3
SCL: CN10.3 ; port C_SCL
SCL1: CN9.11 ; port L_SCL
SDA1: CN9.12 ; port L_SDA
SDATA: CN10.4 ; port C_SDATA
SRV: CN15.3 ; port SERVO
STEP1: CN8.9
STEP2: CN8.11
STEP3: CN8.13
STEP4: CN8.15
STEP5: CN8.17
UART: CN8.20 ; port UART
uSD_CLK: CN7.12 ; port E_uSD_CLK
uSD_CMD: CN7.11 ; port E_uSD_CMD
uSD_D0: CN7.13
uSD_D1: CN7.14
uSD_D2: CN7.9
uSD_D3: CN7.10
uSD_DETECT: CN7.8 ; port E_uSD_DTC
VCP_RX: CN7.2 ; port E_VCP_RX
VCP_TX: CN7.1 ; port E_VCP_TX
WIFI_RX: CN7.30 ; port E_WIFI_RX
WIFI_TX: CN7.29 ; port E_WIFI_TX
XCLK: CN10.8 ; port C_XCLK
Z-: CN15.5 ; port Z-

### Buses and harness runs
bus DIR[1..5] = port DIR[1..5]
bus DOUT[0..9] = port DOUT[0..9]
bus STEP[1..5] = port STEP[1..5]
bus uSD_D[0..3] = port E_uSD_D[0..3]

### Notes on the sheet
- (near CN7) EXTENSION BOARD
- (near CN10) CAMERA

### Library data of the parts
C47 = 6SVPC100M: CAP ALUM POLY 100UF 20% 6.3V SMD; manufacturer: Panasonic Electronic Components; ESR (Equivalent Series Resistance): 30mOhm; Lifetime @ Temp.: 2000 Hrs @ 105°C; Ripple Current @ High Frequency: 2.15A @ 100kHz; Ripple Current @ Low Frequency: 107.5mA @ 120Hz; Surface Mount Land Size: 0.209" L x 0.209" W (5.30mm x 5.30mm); Type: Polymer; Part Number: 6SVPC100M; Applications: General Purpose; Capacitance: 100µF; componentlink1description: Datasheet; componentlink1url: https://industrial.panasonic.com/cdbs/www-data/pdf/AAB8000/AAB8000C256.pdf; componentlink2description: DigiKey Link; componentlink2url: http://digikey.com/product-detail/en/panasonic-electronic-components/6SVPC100M/P16606CT-ND/4204442; Device Package: Radial, Can - SMD; Height - Seated (Max): 0.236" (6.00mm); lastupdated: 9/2/2020 1:22:07 AM; Lifecycle Status: Active; Minimum Order: 1; Mounting Type: Surface Mount; Operating Temperature: -55°C ~ 105°C; Package / Case: Radial, Can - SMD; packaging: TapeAndReel; partid: 1943; Part Status: Active; price: 0.51; series: OS-CON™, SVPC; Size / Dimension: 0.197" Dia (5.00mm); Supplier 1: DigiKey; Supplier Part Number 1: P16606CT-ND; Tolerance: ±20%; value: 100µF; Voltage - Rated: 6.3V
C48 = Cap: Capacitor; Published: 8-Jun-2000; LatestRevisionDate: 17-Jul-2002; LatestRevisionNote: Re-released for DXP Platform.; PackageReference: RAD-0.3; Publisher: Altium Limited; PackageDescription: Radial Cap, Thru-Hole; 2 Leads; 0.3 in Pin Spacing
CN7 = FH12-30S-0.5SH: Connector; Manufacturer_Name: Hirose; Datasheet Link: https://datasheet.datasheetarchive.com/originals/dk/DKDS-2/23451.pdf; Height: 4.8mm; Manufacturer_Part_Number: FH12-30S-0.5SH
CN8 = FH12-26S-0.5SH_55_: Connector; Manufacturer_Name: Hirose; Manufacturer_Part_Number: FH12-26S-0.5SH(55); Datasheet Link: https://datasheet.datasheetarchive.com/originals/distributors/SFDatasheet-1/sf-00023459.pdf; Height: 2.2mm; Mouser Part Number: 798-FH12-26S-0.5SH55; Mouser Price/Stock: https://www.mouser.co.uk/ProductDetail/Hirose-Connector/FH12-26S-0.5SH55?qs=Ux3WWAnHpjC%2FipJJsmJDaQ%3D%3D; Arrow Part Number: FH12-26S-0.5SH(55); Arrow Price/Stock: https://www.arrow.com/en/products/fh12-26s-0.5sh-55/hirose-electric
CN9 = 1-84953-5: Connector; Manufacturer_Name: TE Connectivity; Datasheet Link: https://www.te.com/commerce/DocumentDelivery/DDEController?Action=showdoc&DocId=Customer+Drawing%7F84953%7FA3%7Fpdf%7FEnglish%7FENG_CD_84953_A3.pdf%7F1-84953-5; Height: 2.74mm; Manufacturer_Part_Number: 1-84953-5; Mouser Part Number: 571-1-84953-5; Mouser Price/Stock: https://www.mouser.co.uk/ProductDetail/TE-Connectivity/1-84953-5?qs=uUkeXfjQ8uS9OOvsO8VIHg%3D%3D; Arrow Part Number: 1-84953-5; Arrow Price/Stock: https://www.arrow.com/en/products/1-84953-5/te-connectivity?region=nac
CN10 = FH12-20S-0.5SH_55_: Connector; Manufacturer_Name: Hirose; Datasheet Link: https://componentsearchengine.com/Datasheets/2/FH12-20S-0.5SH(55).pdf; Manufacturer_Part_Number: FH12-20S-0.5SH(55); Mouser Part Number: 798-FH12-20S-0.5SH55; Mouser Price/Stock: https://www.mouser.co.uk/ProductDetail/Hirose-Connector/FH12-20S-0.5SH55?qs=Ux3WWAnHpjBAoMH%252Bjl1N9Q%3D%3D
CN11 CN13 = B3B-XH-A(LF)(SN): CONN HEADER VERT 3POS 2.5MM; Manufacturer: JST Sales America Inc.; Contact Length - Post: 0.134" (3.40mm); Current Rating (Amps): 3A; Material Flammability Rating: UL94 V-0; Number of Positions: 3; Number of Positions Loaded: All; Pitch - Mating: 0.098" (2.50mm); Shrouding: Shrouded - 4 Wall; Style: Board to Cable/Wire; Voltage Rating: 250V; Part Number: B3B-XH-A(LF)(SN); ComponentLink1Description: Datasheet; ComponentLink1URL: http://www.jst-mfg.com/product/pdf/eng/eXH.pdf; ComponentLink2Description: DigiKey Link; ComponentLink2URL: http://digikey.com/product-detail/en/jst-sales-america-inc/B3B-XH-A-LF-SN/455-2248-ND/1651046; Connector Type: Header; Contact Finish - Mating: Tin; Contact Finish - Post: Tin; Contact Material: Brass; Contact Shape: Square; Contact Type: Male Pin; Fastening Type: Detent Lock; Insulation Color: Natural; Insulation Height: 0.276" (7.00mm); Insulation Material: Polyamide (PA66), Nylon 6/6; LastUpdated: 1/12/2020 11:46:22 PM; Lifecycle Status: Active; Minimum Order: 1; Mounting Type: Through Hole; Number of Rows: 1; Operating Temperature: -25°C ~ 85°C; Packaging: Bulk; PartId: 68; Part Status: Active; Price: 0.19; Series: XH; Supplier 1: DigiKey; Supplier Part Number 1: 455-2248-ND; Termination: Press-Fit, Solder
CN12 CN14 = 282834-2: TERM BLK 2P SIDE ENT 2.54MM PCB; Manufacturer: TE Connectivity AMP Connectors; Current: 10A; Mating Orientation: Horizontal with Board; Number of Levels: 1; Pitch: 0.100" (2.54mm); Positions Per Level: 2; Voltage: 150V; Wire Gauge: 16-30 AWG; Wire Termination: Screw - Rising Cage Clamp; Part Number: 282834-2; Color: Green; ComponentLink1Description: Datasheet; ComponentLink1URL: https://www.te.com/commerce/DocumentDelivery/DDEController?Action=srchrtrv&DocNm=282834&DocType=Customer+Drawing&DocLang=English; ComponentLink2Description: DigiKey Link; ComponentLink2URL: http://digikey.com/product-detail/en/te-connectivity-amp-connectors/282834-2/A98333-ND/1150135; LastUpdated: 1/15/2020 4:15:38 AM; Lifecycle Status: Active; Minimum Order: 1; Mounting Type: Through Hole; Packaging: Bulk; Part Status: Active; Price: 0.88; Series: Buchanan; Supplier 1: DigiKey; Supplier Part Number 1: A98333-ND
CN15 = B5B-PH-K-S(LF)(SN): CONN HEADER VERT 5POS 2MM; Manufacturer: JST Sales America Inc.; Contact Length - Mating: 0.130" (3.30mm); Contact Length - Post: 0.134" (3.40mm); Current Rating (Amps): 2A; Material Flammability Rating: UL94 V-0; Number of Positions: 5; Number of Positions Loaded: All; Overall Contact Length: 0.333" (8.45mm); Pitch - Mating: 0.079" (2.00mm); Shrouding: Shrouded - 4 Wall; Style: Board to Cable/Wire; Voltage Rating: 100V; Part Number: B5B-PH-K-S(LF)(SN); ComponentLink1Description: Datasheet; ComponentLink1URL: http://www.jst-mfg.com/product/pdf/eng/ePH.pdf; ComponentLink2Description: DigiKey Link; ComponentLink2URL: http://digikey.com/product-detail/en/jst-sales-america-inc/B5B-PH-K-S-LF-SN/455-1707-ND/926614; Connector Type: Header; Contact Finish - Mating: Tin; Contact Finish - Post: Tin; Contact Material: Brass; Contact Shape: Square; Contact Type: Male Pin; Fastening Type: Detent Lock; Insulation Color: Natural; Insulation Height: 0.236" (6.00mm); Insulation Material: Polyamide (PA66), Nylon 6/6; LastUpdated: 1/12/2020 10:30:05 PM; Lifecycle Status: Active; Minimum Order: 1; Mounting Type: Through Hole; Number of Rows: 1; Operating Temperature: -25°C ~ 85°C; Packaging: Bulk; PartId: 28; Part Status: Active; Price: 0.29; Series: PH; Supplier 1: DigiKey; Supplier Part Number 1: 455-1707-ND; Termination: Press-Fit, Solder
CN16 = Header 6: Header, 6-Pin; LatestRevisionDate: 17-Jul-2002; LatestRevisionNote: Re-released for DXP Platform.; Publisher: Altium Limited

## Sheet Memory.SchDoc
size A; SheetNumber: 2; SheetTotal: 6
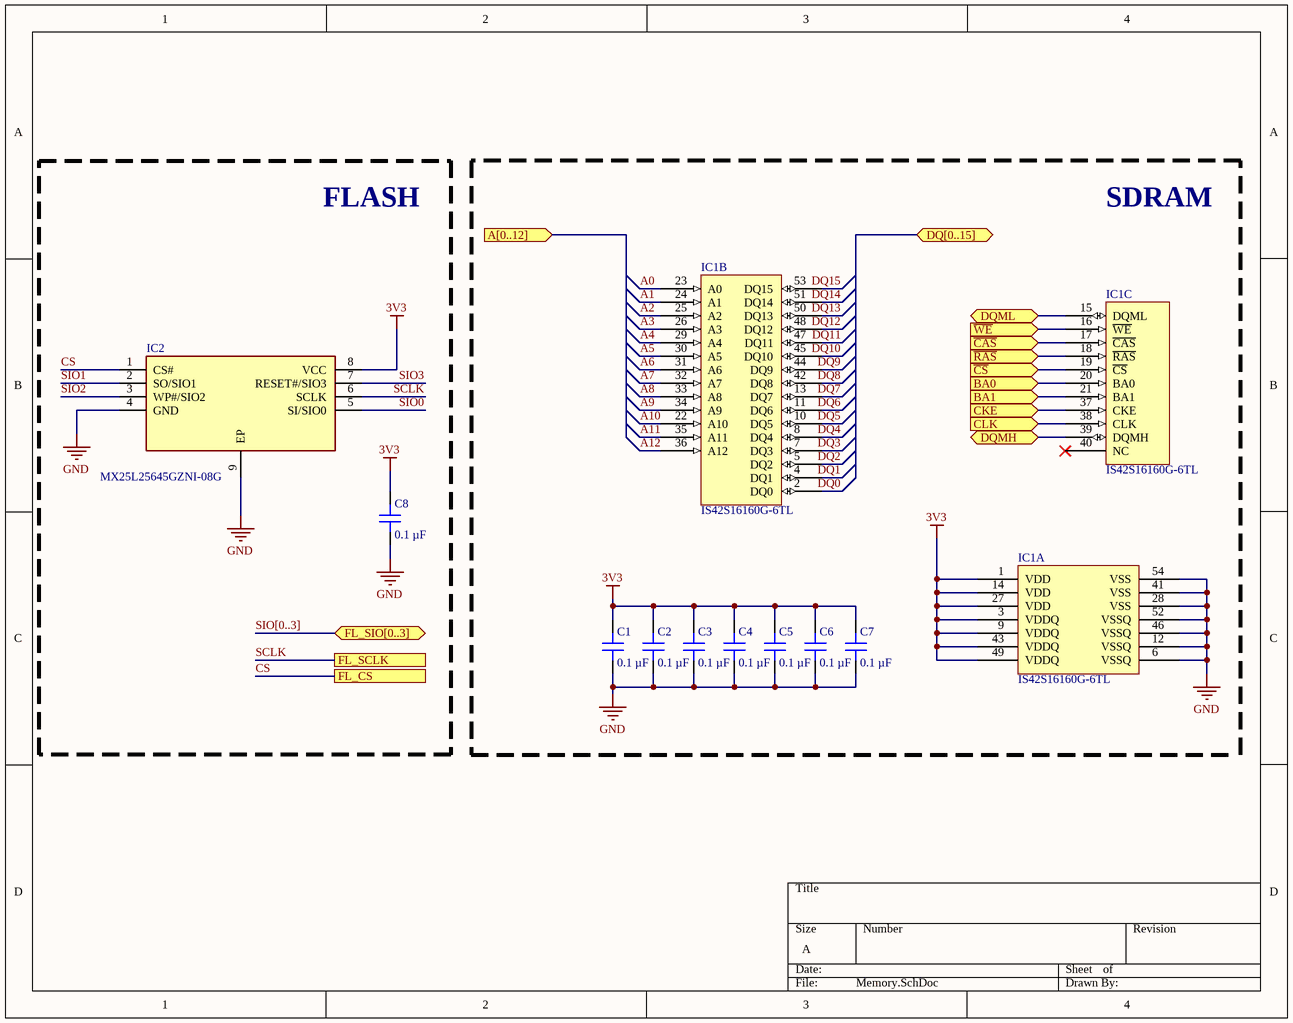
[diagram p3: Memory.SchDoc]

### Parts
C1  0.1 µF  [CAP 0603_1608]
C2  0.1 µF  [CAP 0603_1608]
C3  0.1 µF  [CAP 0603_1608]
C4  0.1 µF  [CAP 0603_1608]
C5  0.1 µF  [CAP 0603_1608]
C6  0.1 µF  [CAP 0603_1608]
C7  0.1 µF  [CAP 0603_1608]
C8  0.1 µF  [CAP 0603_1608]
IC1  IS42S16160G-6TL  [SOP80P1176X120-54N]  (parts A,B,C of 3)
IC2  MX25L25645GZNI-08G  [SON127P600X500X80-9N-D]

### Blocks framed on the sheet
FLASH: C8 IC2

### Ports
A[0..12] (in, see Motherboard[1A], STM32F7[1A]), BA0 (in, see Motherboard[1A], STM32F7[1A]), BA1 (in, see Motherboard[1A], STM32F7[1A]), CKE (in, see Motherboard[1A], STM32F7[1A]), CLK (in, see Motherboard[1A], STM32F7[1A]), DQ[0..15] (bidir, see Motherboard[1A], STM32F7[1A]), DQMH (bidir, see Motherboard[1A], STM32F7[2A]), DQML (bidir, see Motherboard[1A], STM32F7[2A]), FL_CS (see Motherboard[1B], STM32F7[1A]), FL_SCLK (see Motherboard[1B], STM32F7[1A]), FL_SIO[0..3] (bidir, see Motherboard[1A], STM32F7[1A]), ~{CAS} (in, see Motherboard[1A], STM32F7[2A]), ~{CS} (in, see Motherboard[1A], STM32F7[2A]), ~{RAS} (in, see Motherboard[1A], STM32F7[2A]), ~{WE} (in, see Motherboard[1A], STM32F7[2A])

### Nets
3V3: C1.2 C2.2 C3.2 C4.2 C5.2 C6.2 C7.2 C8.2 IC1.1(VDD) IC1.3(VDDQ) IC1.9(VDDQ) IC1.14(VDD) IC1.27(VDD) IC1.43(VDDQ) IC1.49(VDDQ) IC2.8(VCC)
GND: C1.1 C2.1 C3.1 C4.1 C5.1 C6.1 C7.1 C8.1 IC1.6(VSSQ) IC1.12(VSSQ) IC1.28(VSS) IC1.41(VSS) IC1.46(VSSQ) IC1.52(VSSQ) IC1.54(VSS) IC2.4(GND) IC2.9(EP)
~{CAS}: IC1.17(~{CAS}) ; port ~{CAS}
~{CS}: IC1.19(~{CS}) ; port ~{CS}
~{RAS}: IC1.18(~{RAS}) ; port ~{RAS}
~{WE}: IC1.16(~{WE}) ; port ~{WE}
A0: IC1.23(A0)
A1: IC1.24(A1)
A2: IC1.25(A2)
A3: IC1.26(A3)
A4: IC1.29(A4)
A5: IC1.30(A5)
A6: IC1.31(A6)
A7: IC1.32(A7)
A8: IC1.33(A8)
A9: IC1.34(A9)
A10: IC1.22(A10)
A11: IC1.35(A11)
A12: IC1.36(A12)
BA0: IC1.20(BA0) ; port BA0
BA1: IC1.21(BA1) ; port BA1
CKE: IC1.37(CKE) ; port CKE
CLK: IC1.38(CLK) ; port CLK
CS: IC2.1(CS#) ; port FL_CS
DQ0: IC1.2(DQ0)
DQ1: IC1.4(DQ1)
DQ2: IC1.5(DQ2)
DQ3: IC1.7(DQ3)
DQ4: IC1.8(DQ4)
DQ5: IC1.10(DQ5)
DQ6: IC1.11(DQ6)
DQ7: IC1.13(DQ7)
DQ8: IC1.42(DQ8)
DQ9: IC1.44(DQ9)
DQ10: IC1.45(DQ10)
DQ11: IC1.47(DQ11)
DQ12: IC1.48(DQ12)
DQ13: IC1.50(DQ13)
DQ14: IC1.51(DQ14)
DQ15: IC1.53(DQ15)
DQMH: IC1.39(DQMH) ; port DQMH
DQML: IC1.15(DQML) ; port DQML
SCLK: IC2.6(SCLK) ; port FL_SCLK
SIO0: IC2.5(SI/SIO0)
SIO1: IC2.2(SO/SIO1)
SIO2: IC2.3(WP#/SIO2)
SIO3: IC2.7(RESET#/SIO3)

Not connected (* = marked no-connect by the designer): IC1 40(NC)*

### Buses and harness runs
bus  = port A[0..12]
bus SIO[0..3] = port FL_SIO[0..3]

### Notes on the sheet
- SDRAM

### Library data of the parts
C1-C8 = 0603B104K101CT: as C17 on sheet STM32F7; Part Number: 0603B104K101CT; Value: 0.1 µF; Applications: General Purpose; Capacitance: 0.1 µF; componentlink1description: Datasheet; componentlink1url: http://www.passivecomponent.com/wp-content/uploads/2018/10/MLCC.pdf; componentlink2description: DigiKey Link; componentlink2url: https://www.digikey.com/en/products/detail/walsin-technology-corporation/0603B104K101CT/9354889; Device Package: 0603 (1608 Metric); lastupdated: 4/8/2023 7:09:18 PM; Lifecycle Status: Active; Minimum Order: 1; Mounting Type: Surface Mount, MLCC; Operating Temperature: -55°C ~ 125°C; Package / Case: 0603 (1608 Metric); packaging: TapeAndReel; partid: 4273; Part Status: Active; price: 0.01; series: -; Size / Dimension: 0.063" L x 0.031" W (1.60mm x 0.80mm); Supplier 1: DigiKey; Supplier Part Number 1: 1292-1392-1-ND; Temperature Coefficient: X7R; Thickness (Max): 0.037" (0.95mm); Voltage - Rated: 100V
IC1 = IS42S16160G-6TL: Integrated Circuit; Manufacturer_Name: Integrated Silicon Solution Inc.; Datasheet Link: http://www.issi.com/WW/pdf/42-45S83200G-16160G.pdf; Height: 1.2mm; Manufacturer_Part_Number: IS42S16160G-6TL; Mouser Part Number: 870-IS42S16160G-6TL; Mouser Price/Stock: https://www.mouser.co.uk/ProductDetail/ISSI/IS42S16160G-6TL?qs=9hm%252BDT1Jr7z36E7PiUiieg%3D%3D; Arrow Part Number: IS42S16160G-6TL; Arrow Price/Stock: https://www.arrow.com/en/products/is42s16160g-6tl/integrated-silicon-solution-inc
IC2 = MX25L25645GZNI-08G: Integrated Circuit; Manufacturer_Name: Macronix; Datasheet Link: https://www.macronix.com/Lists/Datasheet/Attachments/7858/MX25L25645G,%203V,%20256Mb,%20v1.9.pdf; Height: 0.8mm; Manufacturer_Part_Number: MX25L25645GZNI-08G; Arrow Part Number: MX25L25645GZNI-08G; Arrow Price/Stock: https://www.arrow.com/en/products/mx25l25645gzni-08g/macronix-international?region=nac